# EAGLE design BR111_MKL_3042_Lichtplatine_V4 (EAGLE 5.10)
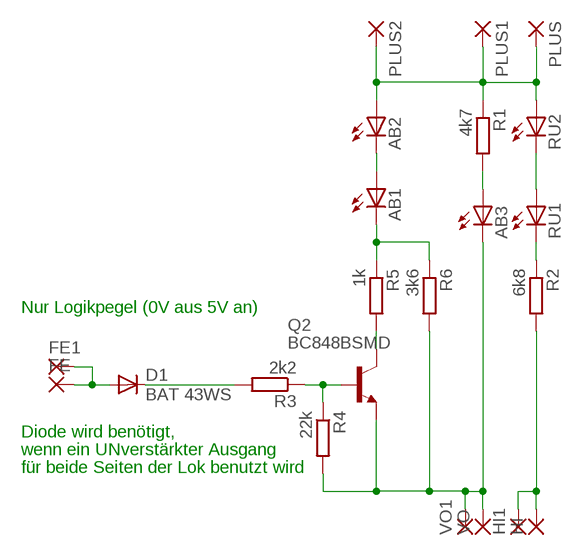
[diagram p0: schematic, sheet 1]

## Parts
AB1  LEDCHIP-LED0603  [CHIP-LED0603]
AB2  LEDCHIP-LED0603  [CHIP-LED0603]
AB3  LEDCHIP-LED0603  [CHIP-LED0603]
D1  BAT 43WS  DIODE-SOD323-R2  [SOD323-R2]
FE  SMD2  [SMD1,27-2,54]
FE1  SMD2  [SMD1,27-2,54]
HI  SMD2  [SMD1,27-2,54]
HI1  SMD2  [SMD1,27-2,54]
PLUS  SMD2  [SMD1,27-2,54]
PLUS1  SMD2  [SMD1,27-2,54]
PLUS2  SMD2  [SMD1,27-2,54]
Q2  BC848BSMD  [SOT23]
R1  4k7  R-EU_R0603  [R0603]
R2  6k8  R-EU_R0603  [R0603]
R3  2k2  R-EU_R0603  [R0603]
R4  22k  R-EU_R0603  [R0603]
R5  1k  R-EU_R0603  [R0603]
R6  3k6  R-EU_R0603  [R0603]
RU1  LEDCHIP-LED0603  [CHIP-LED0603]
RU2  LEDCHIP-LED0603  [CHIP-LED0603]
VO  SMD2  [SMD1,27-2,54]
VO1  SMD2  [SMD1,27-2,54]

## Nets
N$1: AB3.A R1.2
N$2: Q2.1(B) R3.1 R4.1
N$3: AB3.C Q2.2(E) R4.2 R6.2 VO1.1(P) VO.1(P)
N$4: AB1.A AB2.C
N$5: AB1.C R5.1 R6.1
N$6: RU1.A RU2.C
N$7: R2.1 RU1.C
N$8: Q2.3(C) R5.2
N$9: D1.A FE1.1(P) FE.1(P)
N$10: AB2.A PLUS1.1(P) PLUS2.1(P) PLUS.1(P) R1.1 RU2.A
N$11: D1.C R3.2
N$13: HI1.1(P) HI.1(P) R2.2

## Notes on the sheet
- Nur Logikpegel (0V aus 5V an)
- Diode wird benötigt,
- wenn ein UNverstärkter Ausgang
- für beide Seiten der Lok benutzt wird

## Library data of the parts
AB1-AB3 RU1 RU2 = led:LED: LED OSRAM: - CHIPLED LG R971, LG N971, LY N971, LG Q971, LY Q971, LO R971, LY R971 LH N974, LH R974 LS Q976, LO Q976, LY Q976 LO Q996 - Hyper CHIPLED LW Q18S LB Q993, LB Q99A, LB R99A - SideLED LS A670, LO A670, LY A670, LG A670, LP A670 LB A673, LV A673, LT A673, LW A673 LH A674 LY A675 LS A676, LA A676, LO A676, LY A676, LW A676 LS A679, LY A679, LG A679 - Hyper Micro SIDELED® LS Y876, LA Y876, LO Y876, LY Y876 LT Y87S - SmartLED LW L88C, LW L88S LB L89C, LB L89S, LG L890 LS L89K, LO L89K, LY L89K LS L896, LA L896, LO L896, LY L896 - TOPLED LS T670, LO T670, LY T670, LG T670, LP T670 LSG T670, LSP T670, LSY T670, LOP T670, LYG T670 LG T671, LOG T671, LSG T671 LB T673, LV T673, LT T673, LW T673 LH T674 LS T676, LA T676, LO T676, LY T676, LB T676, LH T676, LSB T676, LW T676 LB T67C, LV T67C, LT T67C, LS T67K, LO T67K, LY T67K, LW E67C LS E67B, LA E67B, LO E67B, LY E67B, LB E67C, LV E67C, LT E67C LW T67C LS T679, LY T679, LG T679 LS T770, LO T770, LY T770, LG T770, LP T770 LB T773, LV T773, LT T773, LW T773 LH T774 LS E675, LA E675, LY E675, LS T675 LS T776, LA T776, LO T776, LY T776, LB T776 LHGB T686 LT T68C, LB T68C - Hyper Mini TOPLED® LB M676 - Mini TOPLED Santana® LG M470 LS M47K, LO M47K, LY M47K Source: http://www.osram.convergy.de LUXEON: - LUMILED® LXK2-PW12-R00, LXK2-PW12-S00, LXK2-PW14-U00, LXK2-PW14-V00 LXK2-PM12-R00, LXK2-PM12-S00, LXK2-PM14-U00 LXK2-PE12-Q00, LXK2-PE12-R00, LXK2-PE12-S00, LXK2-PE14-T00, LXK2-PE14-U00 LXK2-PB12-K00, LXK2-PB12-L00, LXK2-PB12-M00, LXK2-PB14-N00, LXK2-PB14-P00, LXK2-PB14-Q00 LXK2-PR12-L00, LXK2-PR12-M00, LXK2-PR14-Q00, LXK2-PR14-R00 LXK2-PD12-Q00, LXK2-PD12-R00, LXK2-PD12-S00 LXK2-PH12-R00, LXK2-PH12-S00 LXK2-PL12-P00, LXK2-PL12-Q00, LXK2-PL12-R00 Source: www.luxeon.com KINGBRIGHT: KA-3528ASYC Source: www.kingbright.com
D1 = diode:DIODE-: DIODE
FE FE1 HI HI1 PLUS PLUS1 PLUS2 VO VO1 = wirepad:SMD2: SMD PAD
Q2 = transistor-npn:BC848*: NPN Transistor
R1-R6 = rcl:R-EU_: RESISTOR, European symbol

## Board
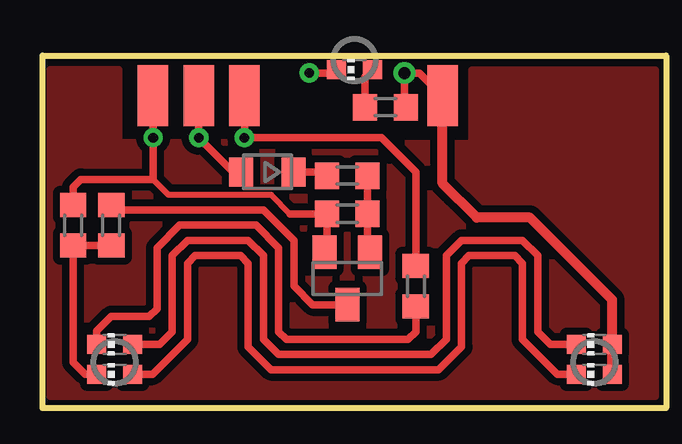
[diagram p1: board, top side]
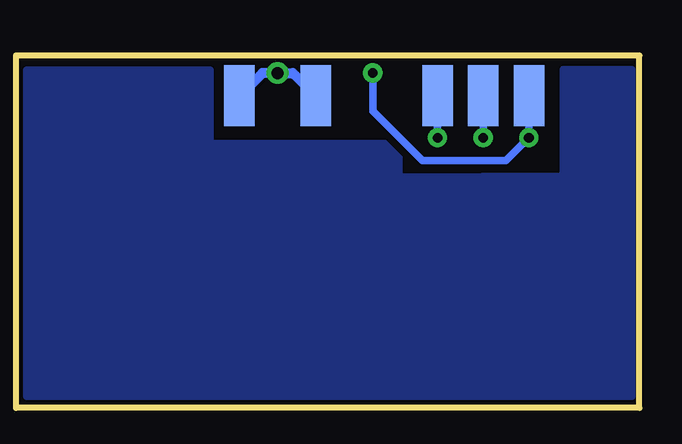
[diagram p2: board, bottom side, seen from below]

No outline drawn. Coordinates in mm, seen from the top.
Copper layers (1*16): Top 0.035mm / dielectric 1.5mm / Bottom 0.035mm
Design rules "default *": minimum track width 7mil, minimum drill 0.6mm, track to track 8mil, track to pad 8mil, pad to pad 8mil, via to via 8mil, smd to smd 8mil, copper to edge 40mil, drill to drill 8mil, minimum pad ring 10mil, minimum via ring 8mil, stop-mask expansion 4mil, vias tented up to drill 0mil, thermal gap 10mil
bKeepout: area 0.2,0.1 to 25.9,14.4
Milling: 4 lines

### Footprints (pad centres in the part's own frame; a part is rotated, then mirrored left to right if it is on the bottom)
CHIP-LED0603 = smd 0.8 x 0.8: A 0,-0.75; C 0,0.75
SOD323-R2 = smd 1 x 1.2: A 1.1,0; C -1.1,0
SMD1,27-2,54 = smd 1.27 x 2.54: 1 0,0
SOT23 = smd 1 x 1.4: 1 -0.95,-1.1; 2 0.95,-1.1; 3 0,1.1
R0603 = smd 1 x 1.1: 1 -0.85,0; 2 0.85,0

### Placement (x,y rotation side)
AB1  3,1.4 90 top
AB2  23,1.4 90 top
AB3  13,14.11 90 top
D1  9.37,9.84 180 top
FE  6.51,13.02 0 top
FE1  6.51,13.02 0 bottom
HI  8.41,13.02 0 bottom
HI1  8.41,13.02 0 top
PLUS  16.67,13.02 0 bottom
PLUS1  16.67,13.02 180 top
PLUS2  13.49,13.02 0 bottom
Q2  12.7,5.4 180 top
R1  14.29,12.54 180 top
R2  15.56,5.08 90 top
R3  12.7,9.68 180 top
R4  12.7,8.1 180 top
R5  2.86,7.62 90 top
R6  1.27,7.62 90 top
RU1  3,2.65 90 top
RU2  23,2.65 90 top
VO  4.6,13.02 0 bottom
VO1  4.6,13.02 0 top

### Tracks (layer width: path | path; a pad name or v marks a point on that pad's centre or on a via)
N$1
  Top 0.305: R1.2 13.44,13.81 AB3.A
N$2
  Top 0.305: R3.1 R4.1 13.55,6.6 Q2.1
N$3  (via drill 0.4)
  Top 0.254: VO1.1 4.59,13.01 | 10.32,8.1 9.53,8.89 5.24,8.89 4.6,9.53
  Top 0.305: R6.2 1.27,9.21 1.59,9.53 4.6,9.53 v4.6,11.27 VO1.1 | AB3.C 12.11,13.97 v11.11,13.97 | Q2.2 11.85,6.6 R4.2 10.32,8.1
  Bottom 0.305: VO1.1 v4.6,11.27 5.56,10.32 9.05,10.32 11.11,12.38 v11.11,13.97
N$4
  Top 0.305: AB2.C 21.46,1.4 20,2.86 20,6.03 19.68,6.35 17.78,6.35 17.46,6.03 17.46,2.54 16.51,1.59 9.53,1.59 8.57,2.54 8.57,6.03 8.26,6.35 6.35,6.35 6.03,6.03 6.03,2.86 4.58,1.4 AB1.A
N$5
  Top 0.305: R6.1 1.27,1.91 1.77,1.4 AB1.C | R6.1 R5.1 | R6.1
N$6
  Top 0.305: RU1.A 4.87,2.65 5.4,3.17 5.4,6.35 6.03,6.99 8.57,6.99 9.21,6.35 9.21,2.86 9.84,2.22 16.19,2.22 16.83,2.86 16.83,6.35 17.46,6.99 20,6.99 20.64,6.35 20.64,3.17 21.16,2.65 RU2.C
N$7
  Top 0.305: RU1.C 2.25,3.2 2.86,3.81 4.45,3.81 4.76,4.13 4.76,6.67 5.71,7.62 8.89,7.62 9.84,6.67 9.84,3.17 10.16,2.86 15.24,2.86 15.56,3.17 R2.1
N$8
  Top 0.254: R5.2 3.07,8.26
  Top 0.305: Q2.3 11.26,4.3 10.48,5.08 10.48,6.99 9.21,8.26 3.07,8.26 R5.2
N$9  (via drill 0.4)
  Top 0.305: FE1.1 v6.51,11.27 7.94,9.84 D1.A
  Bottom 0.305: v6.51,11.27 FE1.1
N$10  (via drill 0.5)
  Top 0.305: PLUS1.1 15.72,13.97 v15.08,13.97 15.08,12.6 R1.1
  Top 0.406: AB2.A RU2.A 23.75,4.51 20.32,7.94 18.1,7.94 16.67,9.37 PLUS1.1
  Bottom 0.406: PLUS1.1 15.72,13.97 v15.08,13.97 14.45,13.97 PLUS2.1
N$11
  Top 0.305: D1.C 11.69,9.84 R3.2
N$13  (via drill 0.4)
  Top 0.254: 8.41,11.91 HI1.1
  Top 0.305: 8.41,11.91 v8.41,11.27 14.13,11.27 15.56,9.84 R2.2
  Bottom 0.305: v8.41,11.27 HI1.1
N$14
  pour Bottom (isolate 0.305): 0.32,0.48 25.55,0.48 25.55,14.08 17.91,14.08 17.91,11.03 10.02,11.03 10.02,9.63 3.17,9.66 3.17,14.11 0.32,14.11
  pour Top (isolate 0.305): 0.32,0.48 25.55,0.48 25.55,14.08 17.91,14.08 17.91,11.03 3.17,11.09 3.17,14.11 0.32,14.11

### Text on the board
tStop: BR111 LED
bStop: BR111 LED | Für Märklin 3042 | design by Janik Merz | + | + | vo | Fl | hi
Document: diese Flächen von Hand ausfeilen | Platinendicke 0,5 bis 1mm